# EAGLE design proximitySensor (EAGLE 7.6.0)
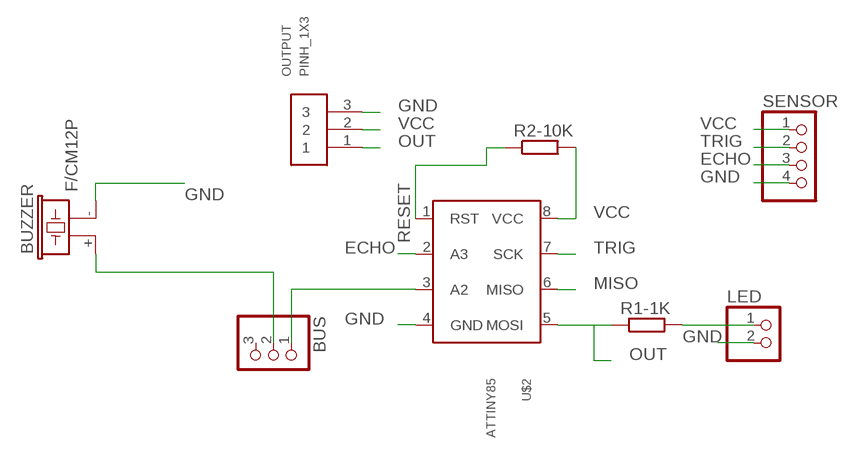
[diagram p0: schematic, sheet 1]

## Parts
BUS  PINHD-1X3  [1X03]
BUZZER  F/CM12P  [F/CM12P]
LED  PINHD-1X2  [1X02]
OUTPUT  PINH_1X3  [PINHEADER]
R1-1K  R-EU_0204/7  [0204/7]
R2-10K  R-EU_0204/7  [0204/7]
SENSOR  PINHD-1X4  [1X04]
U$2  ATTINY85  [DIL-8]

## Nets
ECHO: SENSOR.3 U$2.2(A3)
GND: BUZZER.- LED.2 OUTPUT.3 SENSOR.4 U$2.4(GND)
MISO: U$2.6(MISO)
N$3: BUS.1 U$2.3(A2)
N$12: LED.1 R1-1K.2
N$14: BUS.2 BUZZER.+
OUT: OUTPUT.1 R1-1K.1 U$2.5(MOSI)
RESET: R2-10K.1 U$2.1(RST)
TRIG: SENSOR.2 U$2.7(SCK)
VCC: OUTPUT.2 R2-10K.2 SENSOR.1 U$2.8(VCC)
Unconnected: BUS.3

## Library data of the parts
BUS = pinhead:PINHD-1X3: PIN HEADER
BUZZER = buzzer:F/CM12P: BUZZER Source: Buerklin; OC_FARNELL: unknown; OC_NEWARK: unknown
LED = pinhead:PINHD-1X2: PIN HEADER
OUTPUT = pinhead_2mm:PINH_1X3
R1-1K R2-10K = rcl:R-EU_: RESISTOR, European symbol
SENSOR = pinhead:PINHD-1X4: PIN HEADER
U$2 = attiny:ATTINY85

## Board
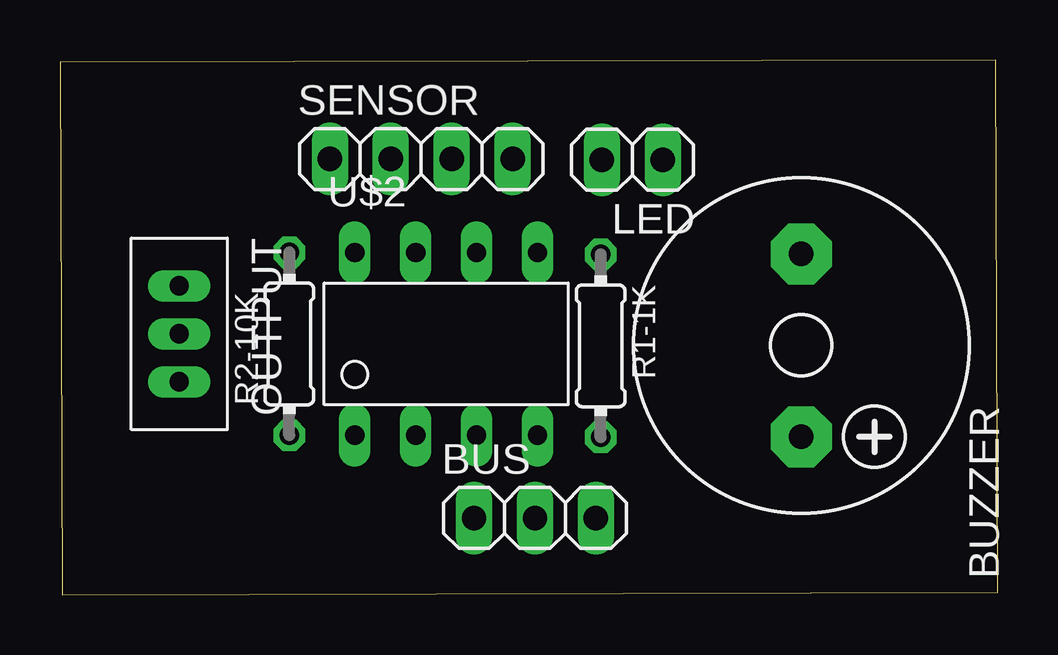
[diagram p1: board, top side]
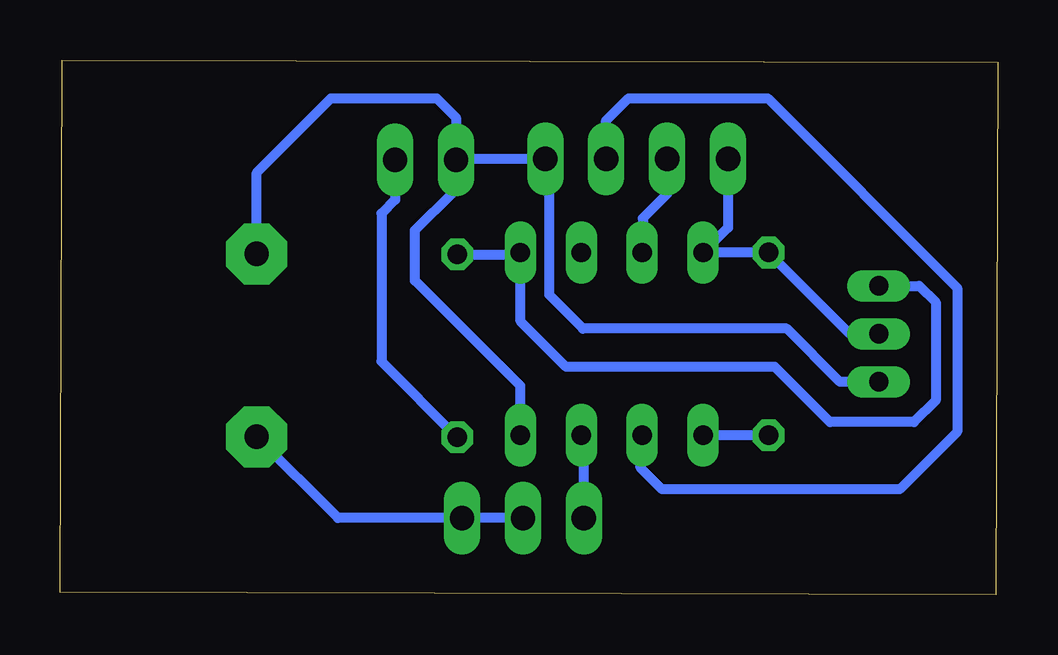
[diagram p2: board, bottom side, seen from below]

Size 39.1 x 22.3 mm. Coordinates in mm from the lower left corner, seen from the top.
Outline: 0.1,0 39.1,0.1 39,22.3 0,22.2 0.1,0
Copper layers (1*16): Top 0.035mm / dielectric 1.5mm / Bottom 0.035mm
Design rules "default": minimum track width 10mil, minimum drill 24mil, track to track 8mil, track to pad 8mil, pad to pad 8mil, via to via 8mil, smd to smd 8mil, copper to edge 40mil, drill to drill 8mil, minimum pad ring 10mil, minimum via ring 8mil, stop-mask expansion 4mil, vias tented up to drill 0mil, thermal gap 10mil

### Footprints (pad centres in the part's own frame; a part is rotated, then mirrored left to right if it is on the bottom)
1X03 = drill 1.016 long: 1 -2.54,0; 2 0,0; 3 2.54,0
F/CM12P = drill 1.016 pad 2.54 octagon: + 3.81,0; - -3.81,0
1X02 = drill 1.016 long: 1 -1.27,0; 2 1.27,0
PINHEADER = drill 0.8 long: 1 -2,0; 2 0,0; 3 2,0
0204/7 = drill 0.813 octagon: 1 -3.81,0; 2 3.81,0
1X04 = drill 1.016 long: 1 -3.81,0; 2 -1.27,0; 3 1.27,0; 4 3.81,0
DIL-8 = drill 0.8 long: 1 -3.81,-6.35; 2 -1.27,-6.35; 3 1.27,-6.35; 4 3.81,-6.35; 5 3.81,1.27; 6 1.27,1.27; 7 -1.27,1.27; 8 -3.81,1.27

### Placement (x,y rotation side)
BUS  19.8,3.2 0 top
BUZZER  30.9,10.4 270 top
LED  23.86,18.14 180 top
OUTPUT  4.97,10.88 270 top
R1-1K  22.54,10.38 270 top
R2-10K  9.56,10.46 90 top
SENSOR  15.06,18.17 0 top
U$2  16.1,13 0 top

### Tracks (layer width: path | path; a pad name or v marks a point on that pad's centre or on a via)
ECHO
  Bottom 0.406: SENSOR.3 16.33,19.77 15.4,20.7 9.6,20.7 1.7,12.8 1.7,6.8 4.1,4.4 14,4.4 14.9,5.3 14.9,6.58 U$2.2
GND
  Bottom 0.406: LED.2 22.56,18.17 SENSOR.4 18.7,18 18.7,12.5 17.3,11.1 8.8,11.1 6.58,8.88 OUTPUT.3 | U$2.4 19.91,8.71 24.3,13.1 24.3,15.2 22.7,16.8 22.7,18.03 LED.2 | BUZZER.- 30.9,17.6 27.8,20.7 23.4,20.7 22.6,19.9 LED.2
N$3
  Bottom 0.406: BUS.1 17.26,6.54 U$2.3
N$12
  Bottom 0.406: LED.1 25.13,16.47 25.7,15.9 25.7,9.73 R1-1K.2
N$14
  Bottom 0.406: BUS.2 27.51,3.2 BUZZER.+
OUT
  Bottom 0.406: R1-1K.1 19.99,14.19 U$2.5 19.9,11.4 18,9.5 9.3,9.5 7,7.2 3.5,7.2 2.6,8.1 2.6,12.2 3.28,12.88 OUTPUT.1
RESET
  Bottom 0.406: R2-10K.1 U$2.1
TRIG
  Bottom 0.406: SENSOR.2 13.79,16.71 14.8,15.7 14.8,14.3 U$2.7
VCC
  Bottom 0.406: SENSOR.1 11.25,15.31 U$2.8 R2-10K.2 6.17,10.88 OUTPUT.2